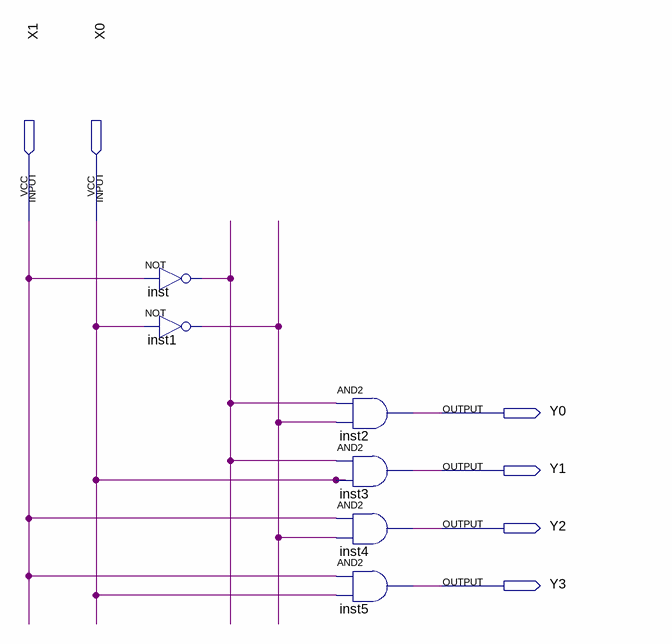
[diagram p0: schematic sheet]
// Quartus schematic lab3_1.bdf as structural Verilog: 6 symbols, 6 pins
module lab3_1 (
  input  X1,
  input  X0,
  output Y0,
  output Y1,
  output Y2,
  output Y3
);

  wire inst1_out, inst_out;

  not inst (inst_out, X1);
  not inst1 (inst1_out, X0);
  and inst2 (Y0, inst_out, inst1_out);
  and inst3 (Y1, inst_out, X0);
  and inst4 (Y2, X1, inst1_out);
  and inst5 (Y3, X1, X0);
endmodule
